# EAGLE design PowerRelayShield (EAGLE 5.11)
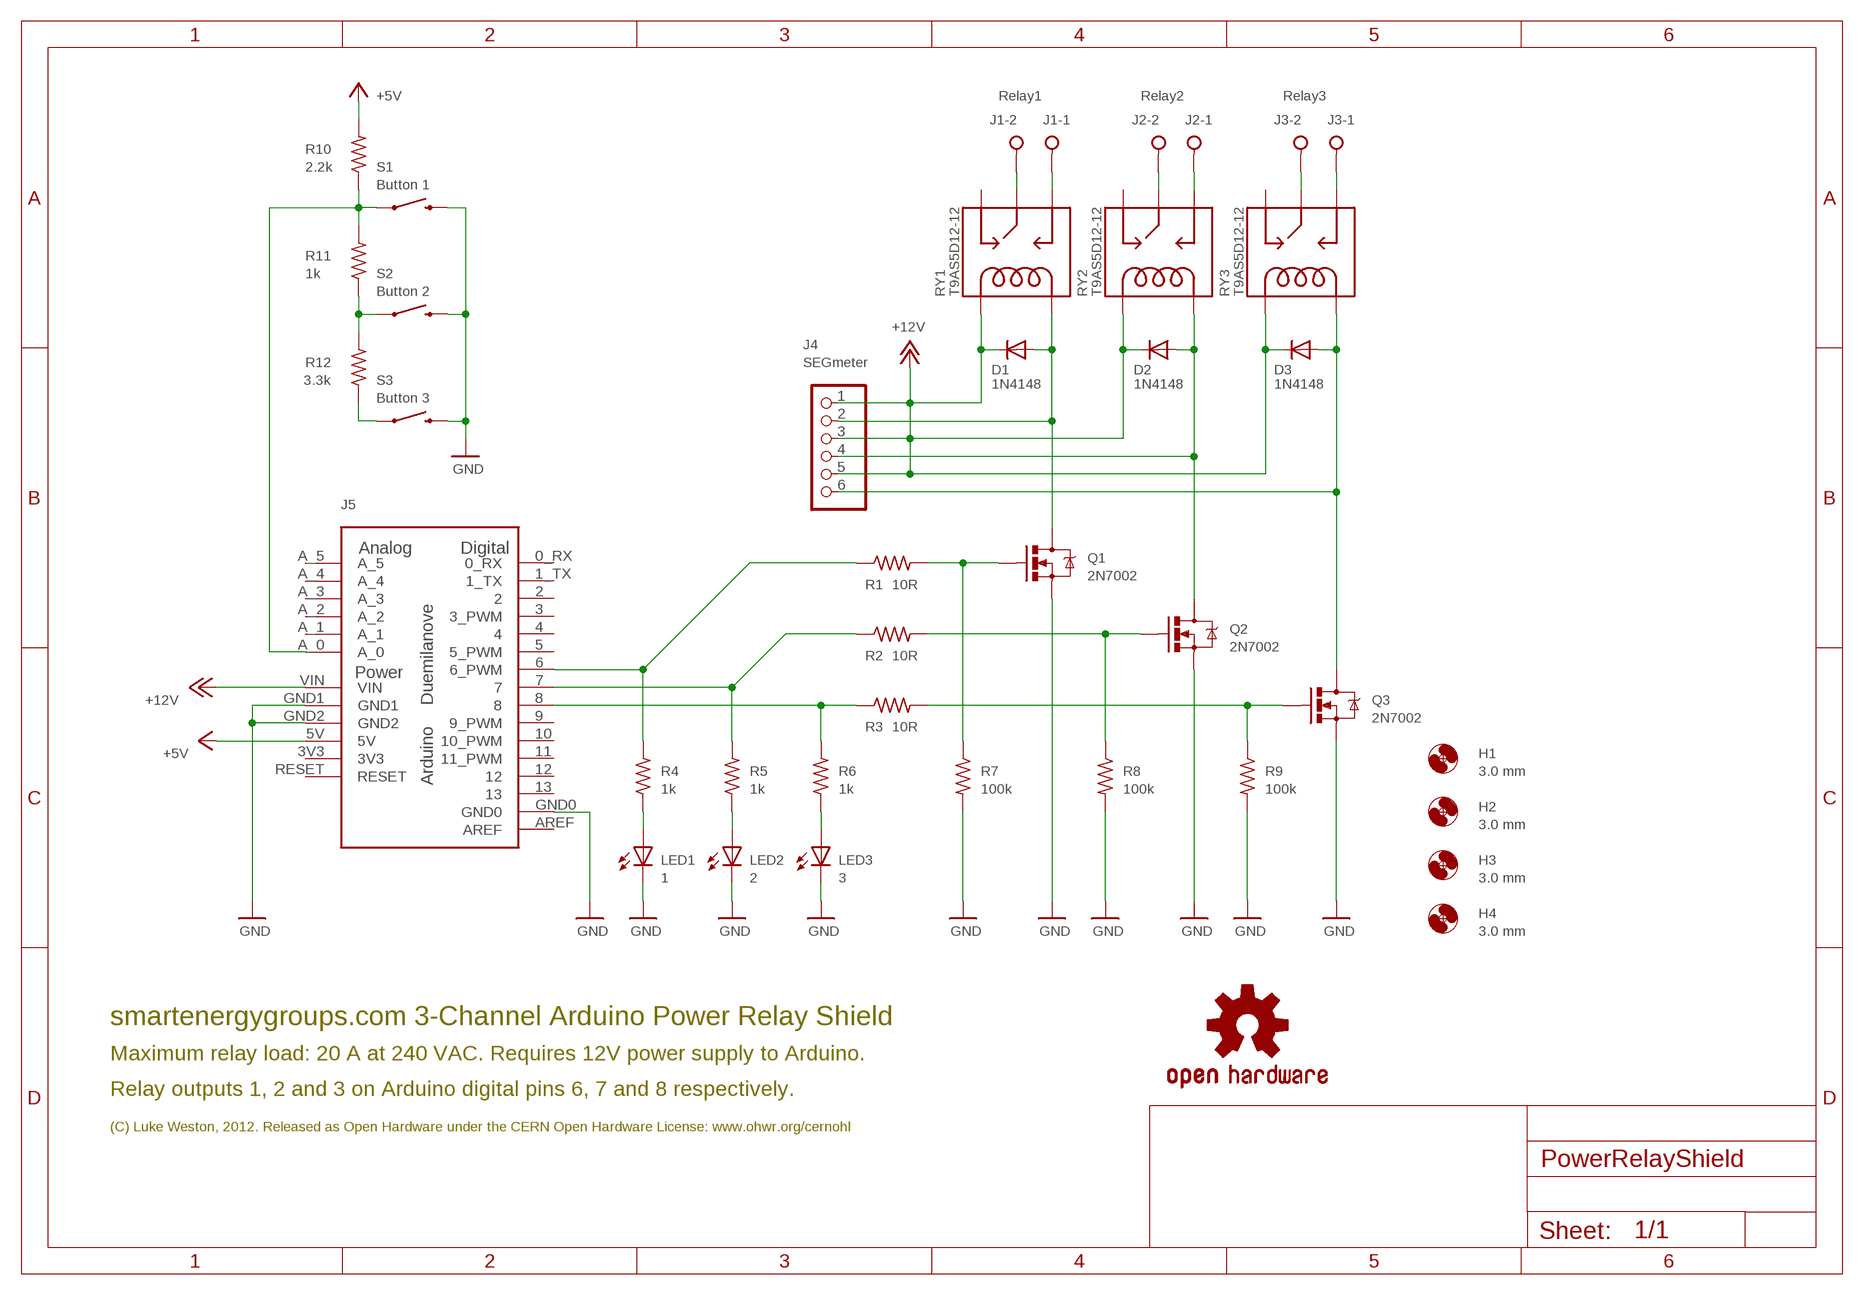
[diagram p0: schematic, sheet 1]

## Parts
D1  1N4148  DIODESOD  [SOD-323]
D2  1N4148  DIODESOD  [SOD-323]
D3  1N4148  DIODESOD  [SOD-323]
H1  3.0 mm  MOUNT-HOLE3.0  [3,0]
H2  3.0 mm  MOUNT-HOLE3.0  [3,0]
H3  3.0 mm  MOUNT-HOLE3.0  [3,0]
H4  3.0 mm  MOUNT-HOLE3.0  [3,0]
J1  Relay1  W237-02P  [W237-132]
J2  Relay2  W237-02P  [W237-132]
J3  Relay3  W237-02P  [W237-132]
J4  SEGmeter  PINHD-1X6  [1X06]
J5  Arduino  ARDUINO-USBLONG_PADS_NO_TEXT  [SHIELD-NOTEXT]
LED1  1  LEDCHIPLED_0805  [CHIPLED_0805]
LED2  2  LEDCHIPLED_0805  [CHIPLED_0805]
LED3  3  LEDCHIPLED_0805  [CHIPLED_0805]
Q1  2N7002  MOSFET-NCHANNELSMD  [SOT23-3]
Q2  2N7002  MOSFET-NCHANNELSMD  [SOT23-3]
Q3  2N7002  MOSFET-NCHANNELSMD  [SOT23-3]
R1  10R  R-US_M0805  [M0805]
R2  10R  R-US_M0805  [M0805]
R3  10R  R-US_M0805  [M0805]
R4  1k  R-US_M0805  [M0805]
R5  1k  R-US_M0805  [M0805]
R6  1k  R-US_M0805  [M0805]
R7  100k  R-US_M0805  [M0805]
R8  100k  R-US_M0805  [M0805]
R9  100k  R-US_M0805  [M0805]
R10  2.2k  R-US_M0805  [M0805]
R11  1k  R-US_M0805  [M0805]
R12  3.3k  R-US_M0805  [M0805]
RY1  T9AS5D12-12  RELAYPTH3  [RELAY-T9A-2]
RY2  T9AS5D12-12  RELAYPTH3  [RELAY-T9A-2]
RY3  T9AS5D12-12  RELAYPTH3  [RELAY-T9A-2]
S1  Button 1  SWITCH-MOMENTARY-2SMD  [TACTILE_SWITCH_SMD]
S2  Button 2  SWITCH-MOMENTARY-2SMD  [TACTILE_SWITCH_SMD]
S3  Button 3  SWITCH-MOMENTARY-2SMD  [TACTILE_SWITCH_SMD]
U$  OSHW-LOGOS  [OSHW-LOGO-S]

## Nets
+5V: J5.5V R10.2
+12V: D1.1(C) D2.1(C) D3.1(C) J4.1 J4.3 J4.5 J5.VIN RY1.COIL1 RY2.COIL1 RY3.COIL1
GND: J5.GND0 J5.GND1 J5.GND2 LED1.C LED2.C LED3.C Q1.2(S) Q2.2(S) Q3.2(S) R7.2 R8.2 R9.2 S1.3 S2.3 S3.3
N$1: LED3.A R6.1
N$2: D1.2(A) J4.2 Q1.3(D) RY1.COIL2
N$3: LED2.A R5.1
N$4: D2.2(A) J4.4 Q2.3(D) RY2.COIL2
N$5: LED1.A R4.1
N$6: D3.2(A) J4.6 Q3.3(D) RY3.COIL2
N$7: J1.2 RY1.MAIN
N$8: J1.1 RY1.NO
N$9: J2.2 RY2.MAIN
N$10: J2.1 RY2.NO
N$11: J3.2 RY3.MAIN
N$12: J3.1 RY3.NO
N$13: J5.A_0 R10.1 R11.2 S1.1
N$14: R12.1 S3.1
N$15: Q1.1(G) R1.2 R7.1
N$16: Q2.1(G) R2.2 R8.1
N$17: R11.1 R12.2 S2.1
N$19: Q3.1(G) R3.2 R9.1
N$20: J5.6(6_PWM) R1.1 R4.2
N$21: J5.7 R2.1 R5.2
N$22: J5.8 R3.1 R6.2
Unconnected: J5.0_RX J5.1_TX J5.2 J5.3(3_PWM) J5.4 J5.5(5_PWM) J5.9(9_PWM) J5.10(10_PWM) J5.11(11_PWM) J5.12 J5.13 J5.A_1 J5.A_2 J5.A_3 J5.A_4 J5.A_5 J5.AREF J5.RESET RY1.NC RY2.NC RY3.NC

## Notes on the sheet
- smartenergygroups.com 3-Channel Arduino Power Relay Shield
- Maximum relay load: 20 A at 240 VAC. Requires 12V power supply to Arduino.
- Relay outputs 1, 2 and 3 on Arduino digital pins 6, 7 and 8 respectively.
- (C) Luke Weston, 2012. Released as Open Hardware under the CERN Open Hardware License: www.ohwr.org/cernohl

## Power pins joined to a net without a drawn wire
3V3: J5.3V3

## Library data of the parts
D1-D3 = SparkFun:DIODE: Diode These are standard reverse protection diodes and small signal diodes. SMA package can handle up to about 1A. SOD-323 can handle about 200mA. What the SOD-323 package when ordering, there are some mfgs out there that are 5-pin packages.
H1-H4 = holes:MOUNT-HOLE: MOUNTING HOLE with drill center marker
J1-J3 = con-wago-508:W237-02P: WAGO SREW CLAMP; OC_FARNELL: unknown; OC_NEWARK: unknown
J4 = pinhead:PINHD-1X6: PIN HEADER
J5 = Arduino-Various:ARDUINO-USB: The Ardiuno Duemilanove Pinouts layoutet as a Bare Shield. v0.5 Also for Arduino Diecimila. This is designed as a Part and has no Outline in the Dimension Layer. The Outline, when present, is drawed at the tPlace / bPlace Layer. Library by Stephanie Lange, http://www.k-ita.de/~sl/
LED1-LED3 = led:LED: LED OSRAM: - CHIPLED LG R971, LG N971, LY N971, LG Q971, LY Q971, LO R971, LY R971 LH N974, LH R974 LS Q976, LO Q976, LY Q976 LO Q996 - Hyper CHIPLED LW Q18S LB Q993, LB Q99A, LB R99A - SideLED LS A670, LO A670, LY A670, LG A670, LP A670 LB A673, LV A673, LT A673, LW A673 LH A674 LY A675 LS A676, LA A676, LO A676, LY A676, LW A676 LS A679, LY A679, LG A679 - Hyper Micro SIDELED® LS Y876, LA Y876, LO Y876, LY Y876 LT Y87S - SmartLED LW L88C, LW L88S LB L89C, LB L89S, LG L890 LS L89K, LO L89K, LY L89K LS L896, LA L896, LO L896, LY L896 - TOPLED LS T670, LO T670, LY T670, LG T670, LP T670 LSG T670, LSP T670, LSY T670, LOP T670, LYG T670 LG T671, LOG T671, LSG T671 LB T673, LV T673, LT T673, LW T673 LH T674 LS T676, LA T676, LO T676, LY T676, LB T676, LH T676, LSB T676, LW T676 LB T67C, LV T67C, LT T67C, LS T67K, LO T67K, LY T67K, LW E67C LS E67B, LA E67B, LO E67B, LY E67B, LB E67C, LV E67C, LT E67C LW T67C LS T679, LY T679, LG T679 LS T770, LO T770, LY T770, LG T770, LP T770 LB T773, LV T773, LT T773, LW T773 LH T774 LS E675, LA E675, LY E675, LS T675 LS T776, LA T776, LO T776, LY T776, LB T776 LHGB T686 LT T68C, LB T68C - Hyper Mini TOPLED® LB M676 - Mini TOPLED Santana® LG M470 LS M47K, LO M47K, LY M47K Source: http://www.osram.convergy.de LUXEON: - LUMILED® LXK2-PW12-R00, LXK2-PW12-S00, LXK2-PW14-U00, LXK2-PW14-V00 LXK2-PM12-R00, LXK2-PM12-S00, LXK2-PM14-U00 LXK2-PE12-Q00, LXK2-PE12-R00, LXK2-PE12-S00, LXK2-PE14-T00, LXK2-PE14-U00 LXK2-PB12-K00, LXK2-PB12-L00, LXK2-PB12-M00, LXK2-PB14-N00, LXK2-PB14-P00, LXK2-PB14-Q00 LXK2-PR12-L00, LXK2-PR12-M00, LXK2-PR14-Q00, LXK2-PR14-R00 LXK2-PD12-Q00, LXK2-PD12-R00, LXK2-PD12-S00 LXK2-PH12-R00, LXK2-PH12-S00 LXK2-PL12-P00, LXK2-PL12-Q00, LXK2-PL12-R00 Source: www.luxeon.com KINGBRIGHT: KA-3528ASYC Source: www.kingbright.com
Q1-Q3 = freetronics-master-v1:MOSFET-NCHANNEL
R1-R12 = resistor:R-US_: RESISTOR, American symbol
RY1-RY3 = SparkFun:RELAY
S1-S3 = SparkFun:SWITCH-MOMENTARY-2
U$ = SparkFun:OSHW-LOGO: Open Source Hardware Logo This logo indicates the piece of hardware it is found on incorporates a OSHW license and/or adheres to the definition of open source hardware found here: http://freedomdefined.org/OSHW

## Board
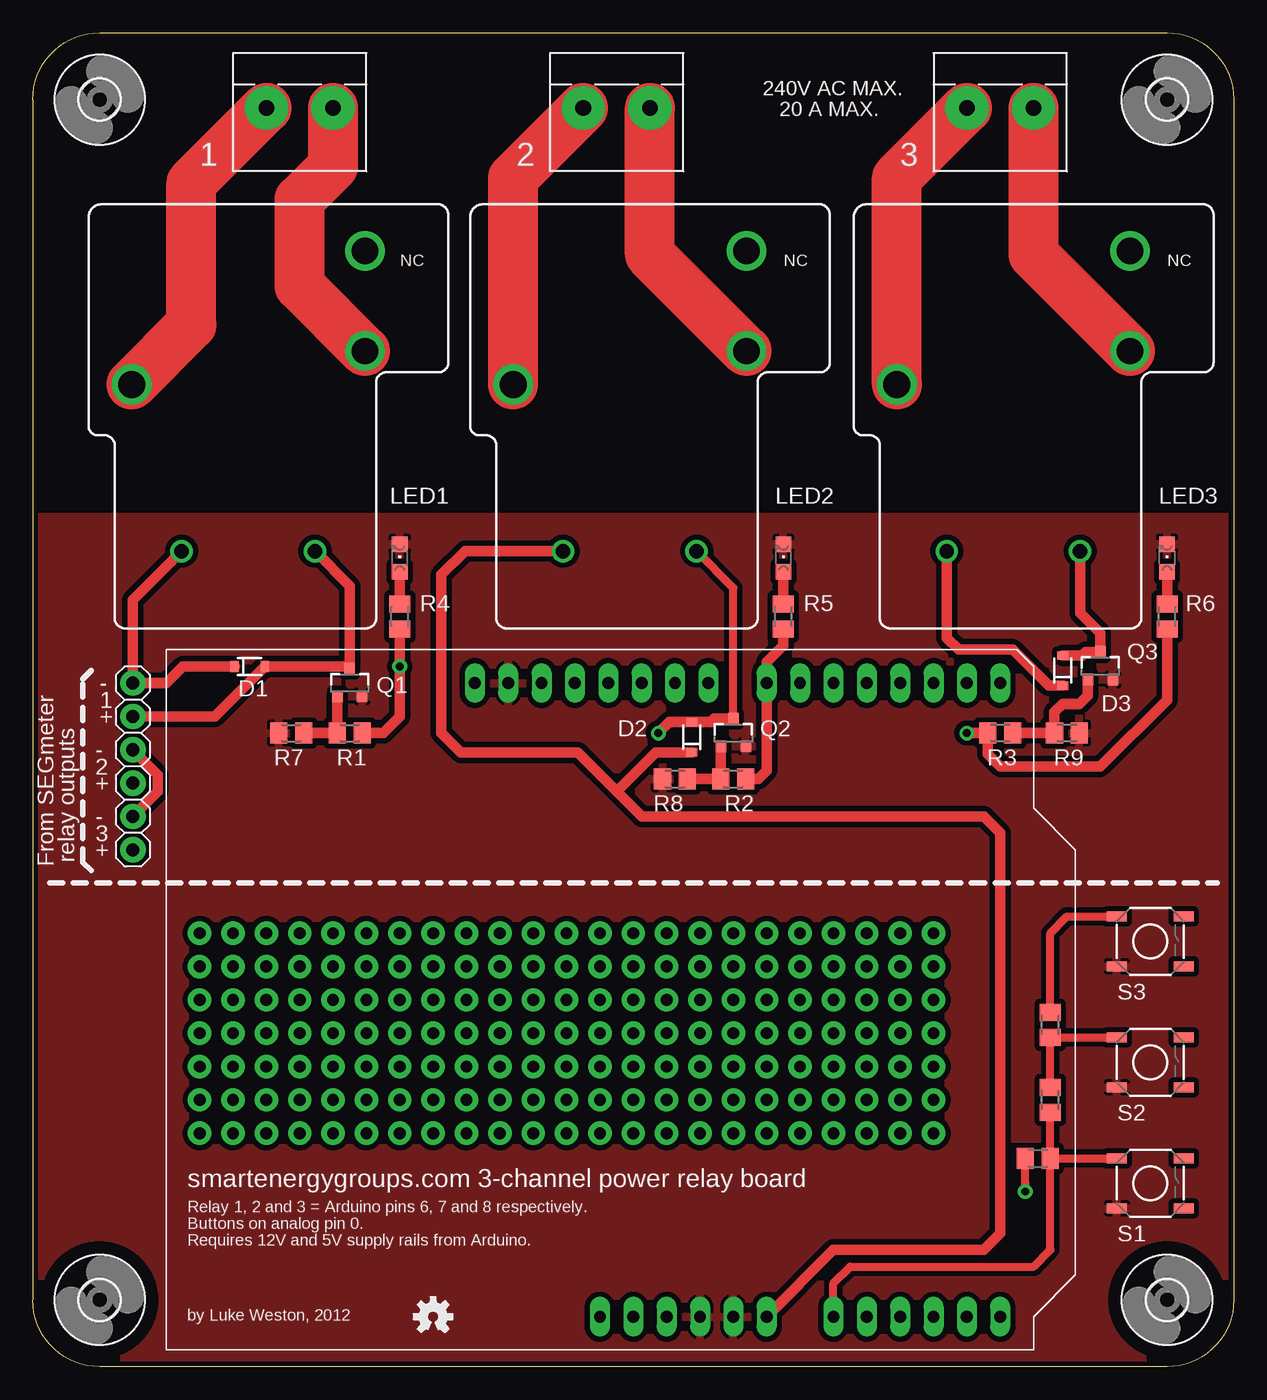
[diagram p1: board, top side]
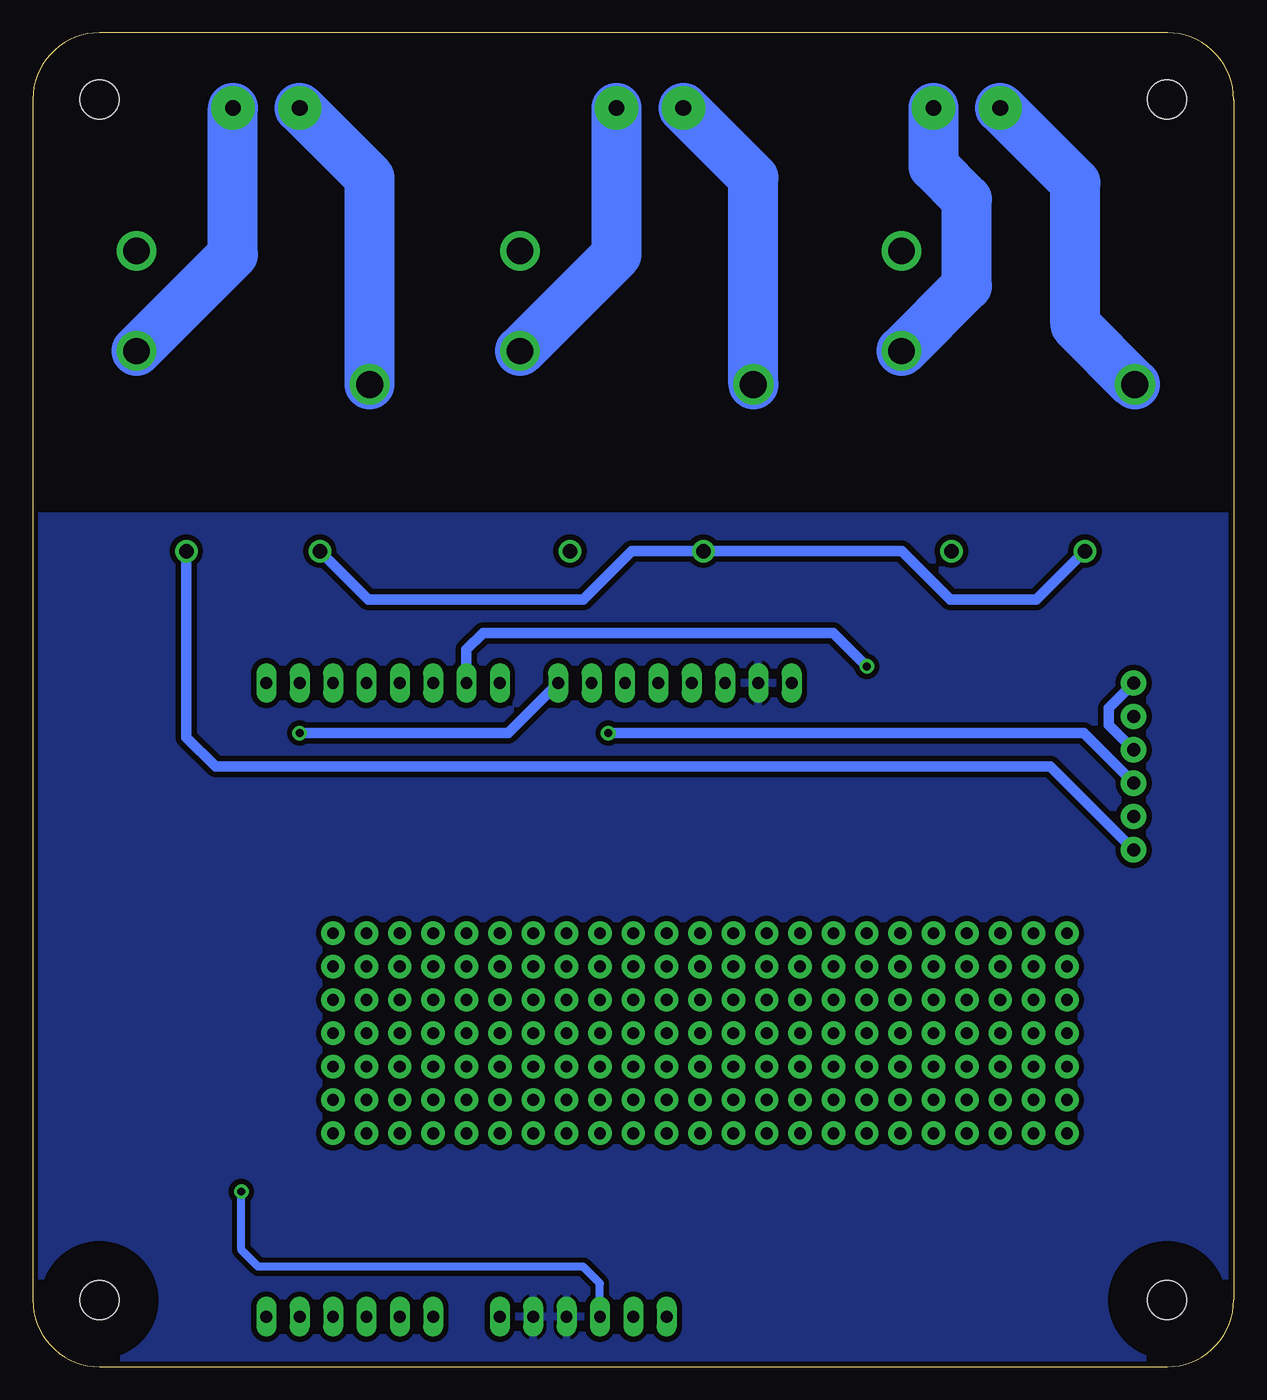
[diagram p2: board, bottom side, seen from below]

Size 91.44 x 101.6 mm. Coordinates in mm from the lower left corner, seen from the top.
Outline: 0,96.52 0,5.08 arc90 5.08,0 86.36,0 arc90 91.44,5.08 91.44,96.52 arc90 86.36,101.6 5.08,101.6 arc90 0,96.52
Copper layers (1*16): Top 0.035mm / dielectric 1.5mm / Bottom 0.035mm
Design rules "SparkFun": minimum track width 8mil, minimum drill 20mil, track to track 8mil, track to pad 8mil, pad to pad 8mil, via to via 8mil, smd to smd 8mil, copper to edge 10mil, drill to drill 8mil, minimum pad ring 12mil, minimum via ring 10mil, stop-mask expansion 4mil, vias tented up to drill 25mil, thermal gap 10mil

### Footprints (pad centres in the part's own frame; a part is rotated, then mirrored left to right if it is on the bottom)
SOD-323 = smd 0.63 x 0.83: 1 -1.15,0; 2 1.15,0
3,0 = hole 3: 0,0
W237-132 = drill 1.194 pad 3.302 round: 1 -2.54,-0.635; 2 2.54,-0.635
1X06 = drill 1 pad 1.93 round: 1 -6.35,0; 2 -3.81,0; 3 -1.27,0; 4 1.27,0; 5 3.81,0; 6 6.35,0
SHIELD-NOTEXT = drill 0.9 pad 1.27 long: 0_RX -25.4,27.94; 1_TX -25.4,25.4; 2 -25.4,22.86; 3 -25.4,20.32; 3V3 22.86,0; 4 -25.4,17.78; 5 -25.4,15.24; 5V 22.86,2.54; 6 -25.4,12.7; 7 -25.4,10.16; 8 -25.4,5.715; 9 -25.4,3.175; 10 -25.4,0.635; 11 -25.4,-1.905; 12 -25.4,-4.445; 13 -25.4,-6.985; A_0 22.86,15.24; A_1 22.86,17.78; A_2 22.86,20.32; A_3 22.86,22.86; A_4 22.86,25.4; A_5 22.86,27.94; AREF -25.4,-12.065; GND0 -25.4,-9.525; GND1 22.86,7.62; GND2 22.86,5.08; RESET 22.86,-2.54; VIN 22.86,10.16
CHIPLED_0805 = smd 1.2 x 1.2: A 0,-1.05; C 0,1.05
SOT23-3 = smd 0.8 x 0.9: 1 -0.95,-1; 2 0.95,-1; 3 0,1.1
M0805 = smd 1.3 x 1.6: 1 -0.95,0; 2 0.95,0
RELAY-T9A-2 = drill 1.1 round: COIL1 -6.61,-10.27; COIL2 3.55,-10.27 | drill 2.057 round: MAIN -10.41,2.43 | drill 2 round: NC 7.35,12.6; NO 7.35,4.97
TACTILE_SWITCH_SMD = smd 1.524 x 0.762: 1 -2.54,1.905; 2 2.54,1.905; 3 -2.54,-1.905; 4 2.54,-1.905

### Placement (x,y rotation side)
D1  16.51,53.34 0 top
D2  50.16,47.94 90 top
D3  78.42,53.02 90 top
H1  5.08,5.08 0 top
H2  5.08,96.52 0 top
H3  86.36,5.08 0 top
H4  86.36,96.52 0 top
J1  20.32,95.25 180 top
J2  44.45,95.25 180 top
J3  73.66,95.25 180 top
J4  7.62,45.72 270 top
J5  45.72,26.67 270 top
LED1  27.94,61.6 0 top
LED2  57.15,61.6 0 top
LED3  86.36,61.6 0 top
Q1  24.13,52.07 0 top
Q2  53.34,48.26 0 top
Q3  81.28,53.34 0 top
R1  24.13,48.26 180 top
R2  53.34,44.77 180 top
R3  73.66,48.26 0 top
R4  27.94,57.15 270 top
R5  57.15,57.15 270 top
R6  86.36,57.15 270 top
R7  19.69,48.26 180 top
R8  48.9,44.77 180 top
R9  78.74,48.26 0 top
R10  76.52,15.88 180 top
R11  77.47,20.32 270 top
R12  77.47,26.04 270 top
RY1  17.94,72.39 0 top
RY2  46.99,72.39 0 top
RY3  76.2,72.39 0 top
S1  85.09,13.97 0 top
S2  85.09,23.18 0 top
S3  85.09,32.38 0 top
U$  30.48,3.81 0 top

### Tracks (layer width: path | path; a pad name or v marks a point on that pad's centre or on a via)
+5V  (via drill 0.6)
  Top 0.61: R10.2 75.57,13.97 v75.56,13.34
  Bottom 0.61: J5.5V 48.26,6.35 49.53,7.62 74.29,7.62 75.56,8.89 v75.56,13.34
+12V
  Top 0.813: RY1.COIL1 7.62,58.41 J4.1 10.16,52.07 11.43,53.34 D1.1 | J4.3 9.52,45.09 9.52,43.81 J4.5 | RY3.COIL1 69.59,55.51 70.48,54.61 74.61,54.61 77.35,51.87 D3.1 | RY2.COIL1 32.91,62.12 31.12,60.33 31.12,48.26 32.58,46.79 41.47,46.79 44.45,43.81 | D2.1 47.43,46.79 44.45,43.81 | 44.45,43.81 46.36,41.91 72.39,41.91 73.66,40.64 73.66,10.16 72.39,8.89 60.96,8.89 J5.VIN
  Bottom 0.813: RY1.COIL1 15.03,58.42 21.59,58.42 25.29,62.12 RY2.COIL1 45.83,62.12 49.53,58.42 65.89,58.42 RY3.COIL1 | J4.1 9.52,50.16 9.52,48.9 J4.3
GND
  pour Top (isolate 0.406): -1.27,64.77 92.71,64.77 92.71,-1.27 -1.27,-1.27
  pour Bottom (isolate 0.406): -1.27,64.77 92.71,64.77 92.71,-1.27 -1.27,-1.27
N$1
  Top 0.813: R6.1 LED3.A
N$2
  Top 0.406: 23.96,53.34 Q1.3
  Top 0.813: Q1.3 24.13,59.48 RY1.COIL2 | 23.96,53.34 D1.2 13.85,49.53 J4.2
N$3
  Top 0.813: R5.1 LED2.A
N$4  (via drill 0.6)
  Top 0.61: Q2.3 53.34,59.32 RY2.COIL2
  Top 0.813: Q2.3 51.9,49.36 51.63,49.09 D2.2 48.46,49.09 v47.62,48.26
  Bottom 0.813: J4.4 11.43,48.26 v47.62,48.26
N$5
  Top 0.813: R4.1 LED1.A
N$6
  Top 0.813: D3.2 79.89,54.17 80.16,54.44 Q3.3 81.28,55.88 79.75,57.41 RY3.COIL2
  Bottom 0.813: RY3.COIL2 79.75,47.94 77.53,45.72 13.97,45.72 J4.6
N$7
  Top 3.81: J1.2 12.07,90.17 12.07,79.36 RY1.MAIN
  Bottom 3.81: J1.2 12.07,90.17 12.07,79.36 RY1.MAIN
N$8
  Top 3.81: J1.1 22.86,91.44 20.32,88.9 20.32,82.33 RY1.NO
  Bottom 3.81: J1.1 22.86,91.44 20.32,88.9 20.32,82.33 RY1.NO
N$9
  Top 3.81: J2.2 36.58,90.55 RY2.MAIN
  Bottom 3.81: RY2.MAIN 36.58,90.55 J2.2
N$10
  Top 3.81: RY2.NO 46.99,84.71 J2.1
  Bottom 3.81: J2.1 46.99,84.71 RY2.NO
N$11
  Top 3.81: J3.2 65.79,90.55 RY3.MAIN
  Bottom 3.81: RY3.MAIN 65.79,90.55 J3.2
N$12
  Top 3.81: RY3.NO 76.2,84.71 J3.1
  Bottom 3.81: J3.1 76.2,84.71 RY3.NO
N$13
  Top 0.61: J5.A_0 60.96,6.35 62.23,7.62 76.2,7.62 77.47,8.89 R10.1 | R11.2 R10.1 | R10.1 S1.1
N$14
  Top 0.61: S3.1 78.74,34.29 77.47,33.02 R12.1
N$15
  Top 0.406: R1.2
  Top 0.813: Q1.1 R1.2 R7.1
N$16
  Top 0.406: Q2.1 52.34,47.31
  Top 0.813: Q2.1 R2.2 R8.1
N$17
  Top 0.406: R12.2
  Top 0.61: R11.1 R12.2 77.51,25.12 | R12.2 S2.1
N$19
  Top 0.406: Q3.1
  Top 0.813: R3.2 R9.1 77.79,49.85 78.42,50.48 79.69,50.48 80.33,51.12 Q3.1
N$20  (via drill 0.6)
  Top 0.813: R4.2 v27.94,53.34 27.94,49.53 26.67,48.26 R1.1
  Bottom 0.813: v27.94,53.34 30.48,55.88 57.15,55.88 58.42,54.61 J5.6
N$21
  Top 0.813: R5.2 57.15,54.93 55.88,53.66 J5.7 55.88,45.4 55.24,44.77 R2.1
N$22  (via drill 0.6)
  Top 0.813: v71.12,48.26 R3.1 72.71,46.67 73.66,45.72 81.28,45.72 86.36,50.8 R6.2
  Bottom 0.813: J5.8 55.24,48.26 v71.12,48.26
N$25  (via drill 0.9 pad 1.78)
  other vias: 68.58,17.78
N$26  (via drill 0.9 pad 1.78)
  other vias: 68.58,20.32
N$27  (via drill 0.9 pad 1.78)
  other vias: 68.58,22.86
N$28  (via drill 0.9 pad 1.78)
  other vias: 68.58,25.4
N$29  (via drill 0.9 pad 1.78)
  other vias: 68.58,27.94
N$30  (via drill 0.9 pad 1.78)
  other vias: 68.58,30.48
N$31  (via drill 0.9 pad 1.78)
  other vias: 68.58,33.02
N$46  (via drill 0.9 pad 1.78)
  other vias: 12.7,33.02
N$47  (via drill 0.9 pad 1.78)
  other vias: 12.7,30.48
N$48  (via drill 0.9 pad 1.78)
  other vias: 12.7,27.94
N$49  (via drill 0.9 pad 1.78)
  other vias: 12.7,25.4
N$50  (via drill 0.9 pad 1.78)
  other vias: 12.7,22.86
N$51  (via drill 0.9 pad 1.78)
  other vias: 12.7,20.32
N$52  (via drill 0.9 pad 1.78)
  other vias: 12.7,17.78
N$59  (via drill 0.9 pad 1.78)
  other vias: 15.24,33.02
N$60  (via drill 0.9 pad 1.78)
  other vias: 17.78,33.02
N$61  (via drill 0.9 pad 1.78)
  other vias: 20.32,33.02
N$62  (via drill 0.9 pad 1.78)
  other vias: 22.86,33.02
N$63  (via drill 0.9 pad 1.78)
  other vias: 25.4,33.02
N$64  (via drill 0.9 pad 1.78)
  other vias: 27.94,33.02
N$65  (via drill 0.9 pad 1.78)
  other vias: 27.94,30.48
N$66  (via drill 0.9 pad 1.78)
  other vias: 30.48,30.48
N$67  (via drill 0.9 pad 1.78)
  other vias: 33.02,30.48
N$68  (via drill 0.9 pad 1.78)
  other vias: 33.02,33.02
N$69  (via drill 0.9 pad 1.78)
  other vias: 30.48,33.02
N$70  (via drill 0.9 pad 1.78)
  other vias: 35.56,33.02
N$71  (via drill 0.9 pad 1.78)
  other vias: 38.1,33.02
N$72  (via drill 0.9 pad 1.78)
  other vias: 40.64,33.02
N$73  (via drill 0.9 pad 1.78)
  other vias: 40.64,30.48
N$74  (via drill 0.9 pad 1.78)
  other vias: 43.18,33.02
N$75  (via drill 0.9 pad 1.78)
  other vias: 45.72,33.02
N$76  (via drill 0.9 pad 1.78)
  other vias: 58.42,33.02
N$77  (via drill 0.9 pad 1.78)
  other vias: 60.96,33.02
N$78  (via drill 0.9 pad 1.78)
  other vias: 63.5,33.02
N$79  (via drill 0.9 pad 1.78)
  other vias: 66.04,33.02
N$80  (via drill 0.9 pad 1.78)
  other vias: 66.04,30.48
N$81  (via drill 0.9 pad 1.78)
  other vias: 66.04,27.94
N$82  (via drill 0.9 pad 1.78)
  other vias: 55.88,33.02
N$83  (via drill 0.9 pad 1.78)
  other vias: 55.88,30.48
N$84  (via drill 0.9 pad 1.78)
  other vias: 50.8,33.02
N$85  (via drill 0.9 pad 1.78)
  other vias: 48.26,33.02
N$86  (via drill 0.9 pad 1.78)
  other vias: 48.26,30.48
N$87  (via drill 0.9 pad 1.78)
  other vias: 53.34,30.48
N$88  (via drill 0.9 pad 1.78)
  other vias: 50.8,30.48
N$89  (via drill 0.9 pad 1.78)
  other vias: 53.34,33.02
N$90  (via drill 0.9 pad 1.78)
  other vias: 15.24,30.48
N$91  (via drill 0.9 pad 1.78)
  other vias: 63.5,30.48
N$92  (via drill 0.9 pad 1.78)
  other vias: 66.04,25.4
N$93  (via drill 0.9 pad 1.78)
  other vias: 66.04,22.86
N$94  (via drill 0.9 pad 1.78)
  other vias: 66.04,20.32
N$95  (via drill 0.9 pad 1.78)
  other vias: 66.04,17.78
N$96  (via drill 0.9 pad 1.78)
  other vias: 63.5,17.78
N$97  (via drill 0.9 pad 1.78)
  other vias: 63.5,20.32
N$98  (via drill 0.9 pad 1.78)
  other vias: 63.5,22.86
N$99  (via drill 0.9 pad 1.78)
  other vias: 63.5,25.4
N$100  (via drill 0.9 pad 1.78)
  other vias: 63.5,27.94
N$101  (via drill 0.9 pad 1.78)
  other vias: 58.42,30.48
N$102  (via drill 0.9 pad 1.78)
  other vias: 60.96,30.48
N$103  (via drill 0.9 pad 1.78)
  other vias: 60.96,27.94
N$104  (via drill 0.9 pad 1.78)
  other vias: 60.96,25.4
N$105  (via drill 0.9 pad 1.78)
  other vias: 60.96,22.86
N$106  (via drill 0.9 pad 1.78)
  other vias: 60.96,20.32
N$107  (via drill 0.9 pad 1.78)
  other vias: 60.96,17.78
N$108  (via drill 0.9 pad 1.78)
  other vias: 58.42,17.78
N$109  (via drill 0.9 pad 1.78)
  other vias: 58.42,20.32
N$110  (via drill 0.9 pad 1.78)
  other vias: 58.42,22.86
N$111  (via drill 0.9 pad 1.78)
  other vias: 58.42,25.4
N$112  (via drill 0.9 pad 1.78)
  other vias: 58.42,27.94
N$113  (via drill 0.9 pad 1.78)
  other vias: 43.18,30.48
N$114  (via drill 0.9 pad 1.78)
  other vias: 45.72,30.48
N$115  (via drill 0.9 pad 1.78)
  other vias: 35.56,30.48
N$116  (via drill 0.9 pad 1.78)
  other vias: 38.1,30.48
N$117  (via drill 0.9 pad 1.78)
  other vias: 17.78,30.48
N$118  (via drill 0.9 pad 1.78)
  other vias: 20.32,30.48
N$119  (via drill 0.9 pad 1.78)
  other vias: 22.86,30.48
N$120  (via drill 0.9 pad 1.78)
  other vias: 25.4,30.48
N$121  (via drill 0.9 pad 1.78)
  other vias: 15.24,17.78
N$122  (via drill 0.9 pad 1.78)
  other vias: 17.78,20.32
N$123  (via drill 0.9 pad 1.78)
  other vias: 20.32,22.86
N$124  (via drill 0.9 pad 1.78)
  other vias: 20.32,20.32
N$125  (via drill 0.9 pad 1.78)
  other vias: 20.32,17.78
N$126  (via drill 0.9 pad 1.78)
  other vias: 17.78,17.78
N$127  (via drill 0.9 pad 1.78)
  other vias: 15.24,20.32
N$128  (via drill 0.9 pad 1.78)
  other vias: 15.24,22.86
N$129  (via drill 0.9 pad 1.78)
  other vias: 17.78,22.86
N$130  (via drill 0.9 pad 1.78)
  other vias: 20.32,25.4
N$131  (via drill 0.9 pad 1.78)
  other vias: 22.86,25.4
N$132  (via drill 0.9 pad 1.78)
  other vias: 25.4,22.86
N$133  (via drill 0.9 pad 1.78)
  other vias: 22.86,22.86
N$134  (via drill 0.9 pad 1.78)
  other vias: 25.4,25.4
N$135  (via drill 0.9 pad 1.78)
  other vias: 27.94,25.4
N$136  (via drill 0.9 pad 1.78)
  other vias: 30.48,25.4
N$137  (via drill 0.9 pad 1.78)
  other vias: 30.48,22.86
N$138  (via drill 0.9 pad 1.78)
  other vias: 27.94,22.86
N$139  (via drill 0.9 pad 1.78)
  other vias: 30.48,20.32
N$140  (via drill 0.9 pad 1.78)
  other vias: 30.48,17.78
N$141  (via drill 0.9 pad 1.78)
  other vias: 27.94,17.78
N$142  (via drill 0.9 pad 1.78)
  other vias: 27.94,20.32
N$143  (via drill 0.9 pad 1.78)
  other vias: 25.4,20.32
N$144  (via drill 0.9 pad 1.78)
  other vias: 22.86,17.78
N$145  (via drill 0.9 pad 1.78)
  other vias: 22.86,20.32
N$146  (via drill 0.9 pad 1.78)
  other vias: 25.4,17.78
N$147  (via drill 0.9 pad 1.78)
  other vias: 30.48,27.94
N$148  (via drill 0.9 pad 1.78)
  other vias: 33.02,17.78
N$149  (via drill 0.9 pad 1.78)
  other vias: 35.56,17.78
N$150  (via drill 0.9 pad 1.78)
  other vias: 38.1,17.78
N$151  (via drill 0.9 pad 1.78)
  other vias: 40.64,17.78
N$152  (via drill 0.9 pad 1.78)
  other vias: 43.18,17.78
N$153  (via drill 0.9 pad 1.78)
  other vias: 45.72,17.78
N$154  (via drill 0.9 pad 1.78)
  other vias: 48.26,17.78
N$155  (via drill 0.9 pad 1.78)
  other vias: 53.34,17.78
N$156  (via drill 0.9 pad 1.78)
  other vias: 50.8,17.78
N$157  (via drill 0.9 pad 1.78)
  other vias: 55.88,17.78
N$158  (via drill 0.9 pad 1.78)
  other vias: 55.88,20.32
N$159  (via drill 0.9 pad 1.78)
  other vias: 55.88,22.86
N$160  (via drill 0.9 pad 1.78)
  other vias: 55.88,25.4
N$161  (via drill 0.9 pad 1.78)
  other vias: 55.88,27.94
N$162  (via drill 0.9 pad 1.78)
  other vias: 22.86,27.94
N$163  (via drill 0.9 pad 1.78)
  other vias: 25.4,27.94
N$164  (via drill 0.9 pad 1.78)
  other vias: 27.94,27.94
N$165  (via drill 0.9 pad 1.78)
  other vias: 20.32,27.94
N$166  (via drill 0.9 pad 1.78)
  other vias: 17.78,27.94
N$167  (via drill 0.9 pad 1.78)
  other vias: 15.24,27.94
N$168  (via drill 0.9 pad 1.78)
  other vias: 15.24,25.4
N$169  (via drill 0.9 pad 1.78)
  other vias: 17.78,25.4
N$170  (via drill 0.9 pad 1.78)
  other vias: 33.02,20.32
N$171  (via drill 0.9 pad 1.78)
  other vias: 33.02,22.86
N$172  (via drill 0.9 pad 1.78)
  other vias: 33.02,25.4
N$173  (via drill 0.9 pad 1.78)
  other vias: 33.02,27.94
N$174  (via drill 0.9 pad 1.78)
  other vias: 35.56,27.94
N$175  (via drill 0.9 pad 1.78)
  other vias: 35.56,25.4
N$176  (via drill 0.9 pad 1.78)
  other vias: 35.56,22.86
N$177  (via drill 0.9 pad 1.78)
  other vias: 35.56,20.32
N$178  (via drill 0.9 pad 1.78)
  other vias: 38.1,20.32
N$179  (via drill 0.9 pad 1.78)
  other vias: 38.1,22.86
N$180  (via drill 0.9 pad 1.78)
  other vias: 38.1,25.4
N$181  (via drill 0.9 pad 1.78)
  other vias: 38.1,27.94
N$182  (via drill 0.9 pad 1.78)
  other vias: 40.64,27.94
N$183  (via drill 0.9 pad 1.78)
  other vias: 43.18,27.94
N$184  (via drill 0.9 pad 1.78)
  other vias: 45.72,27.94
N$185  (via drill 0.9 pad 1.78)
  other vias: 48.26,27.94
N$186  (via drill 0.9 pad 1.78)
  other vias: 50.8,27.94
N$187  (via drill 0.9 pad 1.78)
  other vias: 53.34,27.94
N$188  (via drill 0.9 pad 1.78)
  other vias: 53.34,25.4
N$189  (via drill 0.9 pad 1.78)
  other vias: 53.34,22.86
N$190  (via drill 0.9 pad 1.78)
  other vias: 53.34,20.32
N$191  (via drill 0.9 pad 1.78)
  other vias: 50.8,20.32
N$192  (via drill 0.9 pad 1.78)
  other vias: 48.26,20.32
N$193  (via drill 0.9 pad 1.78)
  other vias: 45.72,20.32
N$194  (via drill 0.9 pad 1.78)
  other vias: 43.18,20.32
N$195  (via drill 0.9 pad 1.78)
  other vias: 40.64,20.32
N$196  (via drill 0.9 pad 1.78)
  other vias: 40.64,22.86
N$197  (via drill 0.9 pad 1.78)
  other vias: 40.64,25.4
N$198  (via drill 0.9 pad 1.78)
  other vias: 43.18,25.4
N$199  (via drill 0.9 pad 1.78)
  other vias: 45.72,25.4
N$200  (via drill 0.9 pad 1.78)
  other vias: 48.26,25.4
N$201  (via drill 0.9 pad 1.78)
  other vias: 50.8,25.4
N$202  (via drill 0.9 pad 1.78)
  other vias: 50.8,22.86
N$203  (via drill 0.9 pad 1.78)
  other vias: 48.26,22.86
N$204  (via drill 0.9 pad 1.78)
  other vias: 45.72,22.86
N$205  (via drill 0.9 pad 1.78)
  other vias: 43.18,22.86

### Text on the board
tPlace: 240V AC MAX. | 20 A MAX. | 1 | 2 | 3 | NC | NC | NC | - | 1 | + | - | 2 | + | - | 3 | From SEGmeter | relay outputs | + | smartenergygroups.com 3-channel power relay board | Relay 1, 2 and 3 = Arduino pins 6, 7 and 8 respectively. | Buttons on analog pin 0. | Requires 12V and 5V supply rails from Arduino. | by Luke Weston, 2012